# EasyEDA Pro project ESD_System.eprj, board PCB7
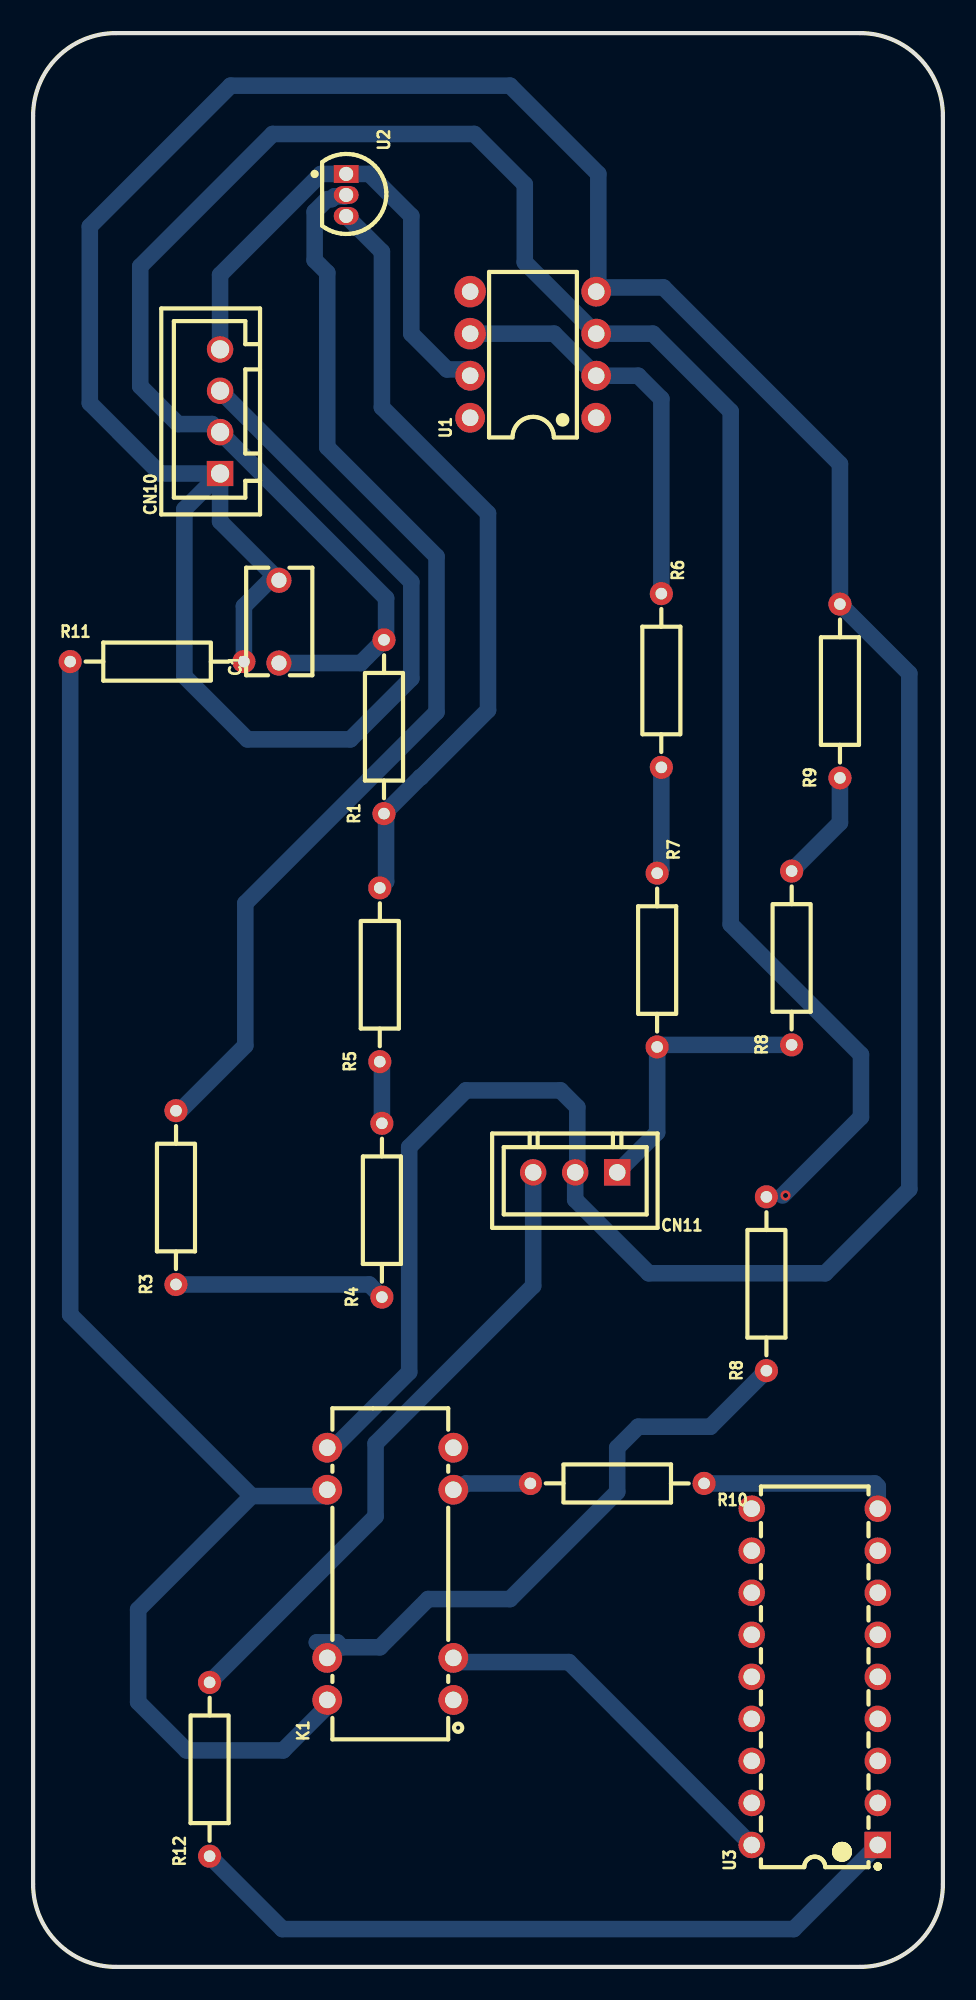
[diagram p10: board, top side]
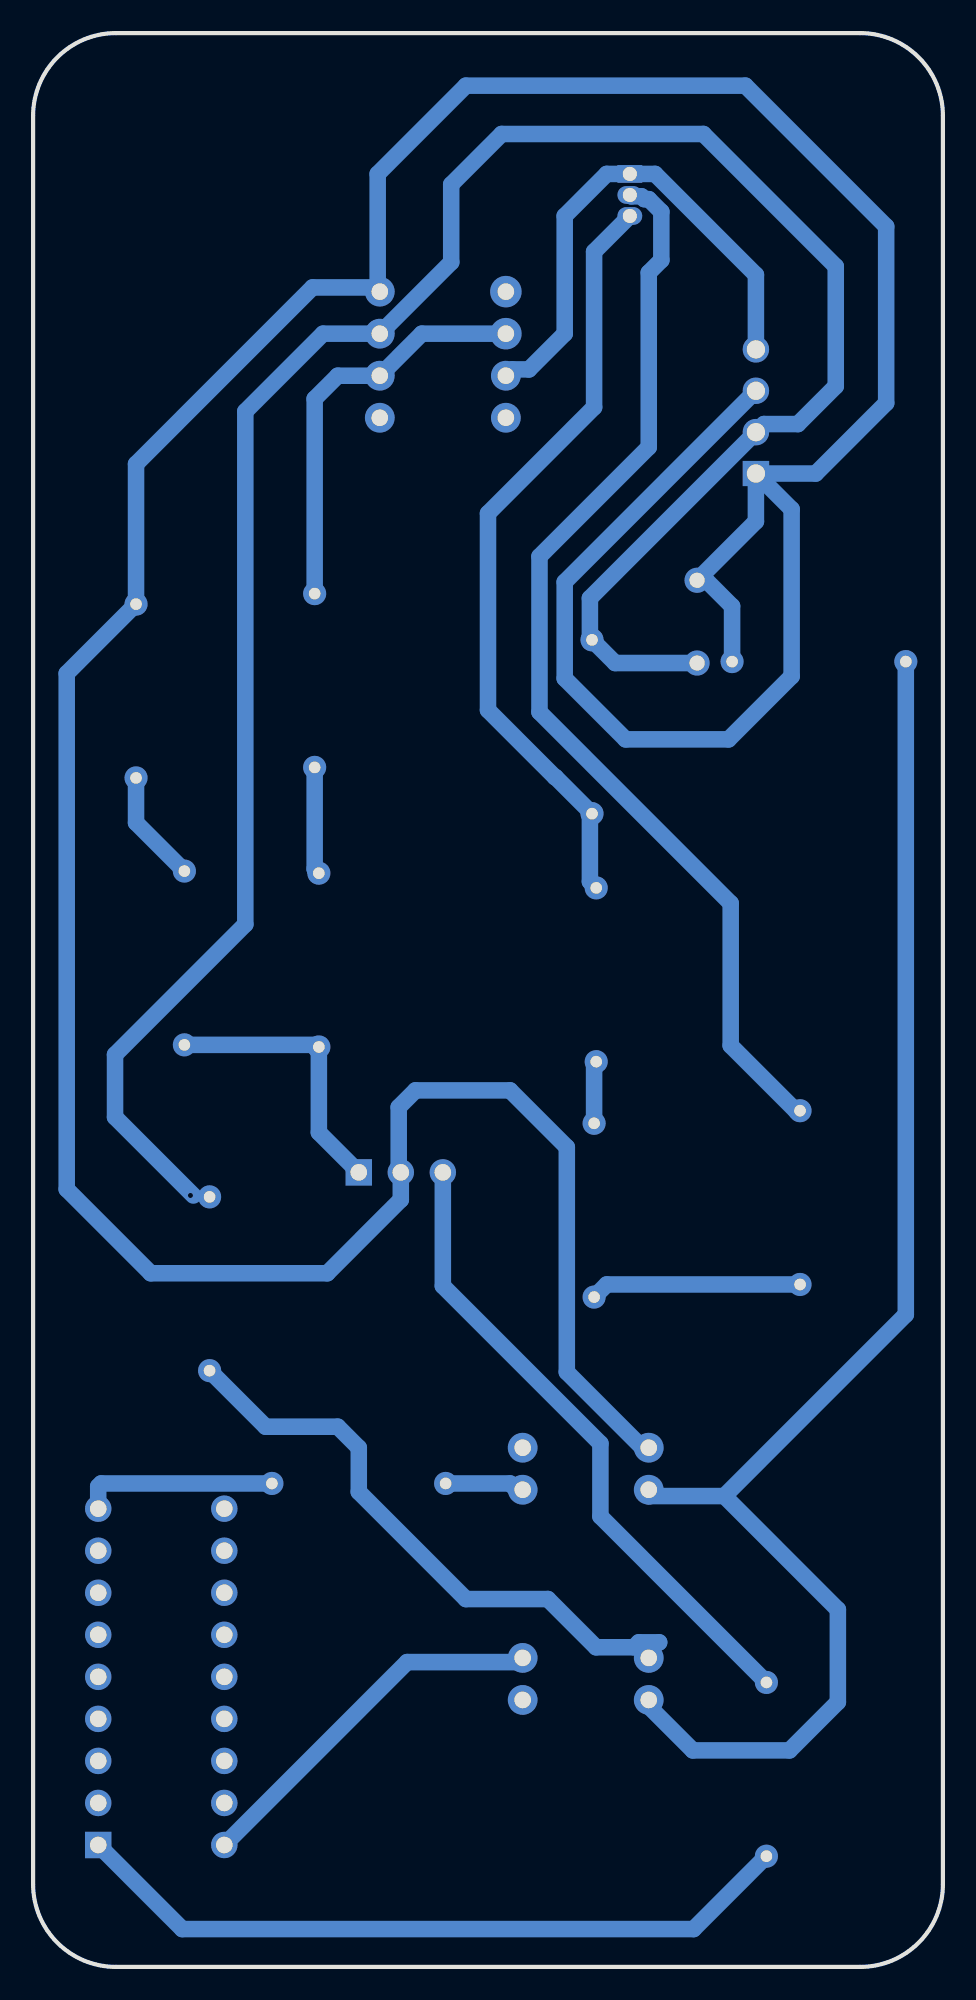
[diagram p11: board, bottom side, seen from below]

Outline 54.99 x 116.84 mm; copper layers: Top Layer, Bottom Layer. Coordinates in mm from the lower left corner of the outline.
Outline path: 0,111.84 0,5 arc(1.46,1.46) 5,0 49.99,0 arc(53.53,1.46) 54.99,5 54.99,111.84 arc(53.53,115.38) 49.99,116.84 5,116.84 arc(1.46,115.38) 0,111.84
Stack: Top Layer 0.035mm / Dielectric1 1.51mm FR4 er 4.5 / Bottom Layer 0.035mm

## Design rules (mm)
template: JLCPCB Capability(Two Layers Board)
spacing copperThickness1oz (default): track to track 0.102, other pairs 0.152 to 0.3
spacing copperThickness2oz: track to track 0.203, other pairs 0.152 to 0.3
track width copperThickness1oz (default): min 0.127, default 0.254, max 2.54
track width copperThickness2oz: min 0.203, default 0.254, max 2.54
differential pair differentialPair (default): width min 0.127, default 0.254, max 2.54; gap min 0.152, default 0.152
via viaSize (default): diameter min 0.5, default 0.61, max 10; hole min 0.3, default 0.305, max 6.3

## Placement (name value [footprint] x y rotation side)
C1  10nF  [CAP-TH_L6.5-W4.0-P5.00-D1.0]  14.86 81.28 90 top
CN10  ZX-XH2.54-4PZZ  [CONN-TH_4P-P2.50_4PIN]  11.3 93.98 90 top
CN11  ZX-XH2.54-3PZZ  [CONN-TH_3P-P2.54_2501S-3P]  32.77 48.01 180 top
K1  HE721A0500  [RELAY-TH_HE721A0500]  21.59 23.75 90 top
NOREF  -  [Pad_e278]  51.56 2.79 0 top
NOREF#2  -  [Pad_e279]  51.31 113.28 0 top
NOREF#3  -  [Pad_e280]  3.68 113.28 0 top
NOREF#4  -  [Pad_e276]  3.81 3.56 0 top
R1  1kΩ  [RES-TH_BD2.3-L6.5-P10.50-D0.5]  21.21 74.93 90 top
R3  1kΩ  [RES-TH_BD2.3-L6.5-P10.50-D0.5]  8.64 46.48 90 top
R4  1kΩ  [RES-TH_BD2.3-L6.5-P10.50-D0.5]  21.08 45.72 90 top
R5  1kΩ  [RES-TH_BD2.3-L6.5-P10.50-D0.5]  20.95 59.94 90 top
R6  1kΩ  [RES-TH_BD2.3-L6.5-P10.50-D0.5]  37.97 77.72 270 top
R7  1kΩ  [RES-TH_BD2.3-L6.5-P10.50-D0.5]  37.72 60.83 270 top
R8  1kΩ  [RES-TH_BD2.3-L6.5-P10.50-D0.5]  44.32 41.27 90 top
R8#2  -  [RES-TH_BD2.3-L6.5-P10.50-D0.5]  45.85 60.96 90 top
R9  1kΩ  [RES-TH_BD2.3-L6.5-P10.50-D0.5]  48.77 77.09 90 top
R10  1kΩ  [RES-TH_BD2.3-L6.5-P10.50-D0.5]  35.31 29.21 180 top
R11  1kΩ  [RES-TH_BD2.3-L6.5-P10.50-D0.5]  7.49 78.87 0 top
R12  1kΩ  [RES-TH_BD2.3-L6.5-P10.50-D0.5]  10.67 11.94 90 top
U1  OPA445AP  [PDIP-8_L9.6-W6.4-P2.54-LS7.6-BL]  30.23 97.41 90 top
U2  LM334Z/LFT1  [TO-92-3_L4.8-W3.7-P1.27-L]  18.92 107.06 270 top
U3  ULN2803APG  [DIP-18_L23.0-W6.5-P2.54-LS7.6-BL]  47.24 17.53 90 top

## Footprints (pads in the part's own frame, mm; a bottom-side part is the same pattern mirrored in y, then rotated)
CAP-TH_L6.5-W4.0-P5.00-D1.0
  round 1.524 hole 0.914: 1(-2.5,0) 2(2.5,0)
CONN-TH_3P-P2.54_2501S-3P
  rect 1.6x1.6 hole 1: 1(-2.54,0)
  round 1.6 hole 1: 2(0,0) 3(2.54,0)
CONN-TH_4P-P2.50_4PIN
  rect 1.524x1.6 hole 1.1: 1(-3.75,0)
  round 1.6 hole 1.1: 2(-1.25,0) 3(1.25,0) 4(3.75,0)
DIP-18_L23.0-W6.5-P2.54-LS7.6-BL
  rect 1.6x1.6 hole 1: 1(-10.16,-3.81)
  round 1.6 hole 1: 2(-7.62,-3.81) 3(-5.08,-3.81) 4(-2.54,-3.81) 5(0,-3.81) 6(2.54,-3.81) 7(5.08,-3.81) 8(7.62,-3.81) 9(10.16,-3.81) 10(10.16,3.81) 11(7.62,3.81) 12(5.08,3.81) 13(2.54,3.81) 14(0,3.81) 15(-2.54,3.81) 16(-5.08,3.81) 17(-7.62,3.81) 18(-10.16,3.81)
Pad_e276
  round 0.003 hole 3: 1(0,0)
Pad_e278
  round 0.003 hole 3: 1(0,0)
Pad_e279
  round 0.003 hole 3: 1(0,0)
Pad_e280
  round 0.003 hole 3: 1(0,0)
PDIP-8_L9.6-W6.4-P2.54-LS7.6-BL
  round 1.8 hole 1: 1(-3.81,-3.81) 2(-1.27,-3.81) 3(1.27,-3.81) 4(3.81,-3.81) 7(-1.27,3.81) 8(-3.81,3.81)
  round 1.905 hole 1: 5(3.81,3.81) 6(1.27,3.81)
RELAY-TH_HE721A0500
  round 1.8 hole 1: 1(-7.62,-3.81) 2(-5.08,-3.81) 6(5.08,-3.81) 7(7.62,-3.81) 8(7.62,3.81) 9(5.08,3.81) 13(-5.08,3.81) 14(-7.62,3.81)
RES-TH_BD2.3-L6.5-P10.50-D0.5
  round 1.4 hole 0.7: 1(-5.25,0) 2(5.25,0)
TO-92-3_L4.8-W3.7-P1.27-L
  rect 1.07x1.5 hole 0.85: 1(-1.27,0)
  oval 1.07x1.5 hole 0.85: 2(0,0) 3(1.27,0)

## Nets
As in the schematic, except:
$1N1102: CN11.1 R7.2 R8.1 R8#2.1
$1N2344: R8.2 R8#2.2 R9.1

Pads without a net: K1 1 7; NOREF 1; NOREF#2 1; NOREF#3 1; NOREF#4 1; U1 1 5 8; U3 2 3 4 5 6 7 8 10 11 12 13 14 15 16 17

## Via types
v1: diameter 0.61, hole 0.305, Top Layer to Bottom Layer, 1 via

## Routing (per net, layer and track width the routed paths; a pad name or vN(x,y) marks a point on that pad's centre or on a via; arc(x,y) is an arc through that point)
$1N601: length 12.8
  Bottom Layer w1: R4.1 20.32,41.23 R3.1
$1N605: length 3.8
  Bottom Layer w1: R5.1 21.08,54.57 R4.2
$1N610: length 46.8
  Bottom Layer w1: R1.1 23.41,71.88 23.44,71.88 27.5,75.94 27.5,87.82 21.08,94.23 21.08,103.63 U2.3 ; R5.2 21.34,65.58 21.34,69.55
$1N617: length 66.4
  Bottom Layer w1: R3.2 8.89,51.73 12.83,55.67 12.83,64.26 24.38,75.82 24.38,85.22 17.78,91.82 17.78,102.36 17.02,103.12 17.02,106.04 17.78,106.81 18.05,106.81 18.22,106.98 18.84,106.98 U2.2
$1N688: length 31.4
  Bottom Layer w1: CN10.4 11.3,102.23 17.4,108.33 U2.1 20.32,108.33 22.86,105.79 22.86,98.68 25.02,96.52 26.04,96.52 U1.7
$1N937: length 25
  Bottom Layer w1: U1.6 31.5,98.68 U1.2 36.58,96.14 37.97,94.74 R6.1
$1N1097: length 6.5
  Bottom Layer w1: R7.1 37.97,66.34 R6.2
$1N1102: length 52.6
  Bottom Layer w1: R8#2.1 37.85,55.71 R7.2 37.72,50.42 CN11.1 ; R8.1 40.94,32.64 36.58,32.64 35.31,31.37 35.31,28.7 28.83,22.22 23.88,22.22 20.96,19.31 18.68,19.31 18.38,19.61 17.15,19.61 17.17,19.59
$1N2021: length 22.5
  Bottom Layer w1: 25.53,18.42 32.38,18.42 43.43,7.37
$1N2069: length 4.8
  Bottom Layer w1: 25.53,28.58 26.16,29.21 R10.2
$1N2161: length 227.2
  Bottom Layer w1: R11.1 2.24,39.41 13.21,28.45 ; 17.91,15.88 15.11,13.08 9.27,13.08 6.35,16 6.35,21.59 13.21,28.45 ; 13.21,28.45 17.78,28.45 17.91,28.58 ; R1.2 19.81,78.78 C1.1 ; 45.3,46.61 50.04,51.34 50.04,55.12 42.16,62.99 42.16,93.98 37.46,98.68 U1.3 29.72,103 29.72,107.7 26.67,110.74 14.48,110.74 6.48,102.74 6.48,95.5 8.76,93.22 10.82,93.22 21.34,82.7 21.34,80.05
  vias: v1(45.48,46.61)
$1N2316: length 11.9
  Bottom Layer w1: U3.9 51.05,29.03 50.87,29.21 R10.1
$1N2341: length 44.3
  Bottom Layer w1: R12.1 15.07,2.29 45.97,2.29 51.05,7.37
$1N2344: length 6.8
  Bottom Layer w1: R9.1 48.77,69.13 R8#2.2
$1N2424: length 38.9
  Bottom Layer w1: R12.2 20.7,27.22 20.7,31.62 30.23,41.15 CN11.3
$1N2446: length 256.7
  Bottom Layer w1: CN10.1 7.69,90.23 3.43,94.49 3.43,105.16 11.94,113.66 28.83,113.66 34.16,108.33 34.16,101.35 34.29,101.47 38.1,101.47 48.77,90.8 R9.2 52.96,78.15 52.96,46.99 47.88,41.91 37.21,41.91 32.77,46.35 CN11.2 32.89,48.13 32.89,51.94 31.88,52.96 26.16,52.96 22.73,49.53 22.73,35.94 17.91,31.12 ; CN10.1 11.3,87.34 C1.2 14.31,83.78 12.74,82.21 R11.2 ; CN10.1 9.14,88.07 9.14,77.98 12.95,74.17 19.18,74.17 22.86,77.85 22.86,83.67 CN10.3
